# EAGLE design KickerBoard (EAGLE 9.2.2)

## Sheet 1 of 3: Power
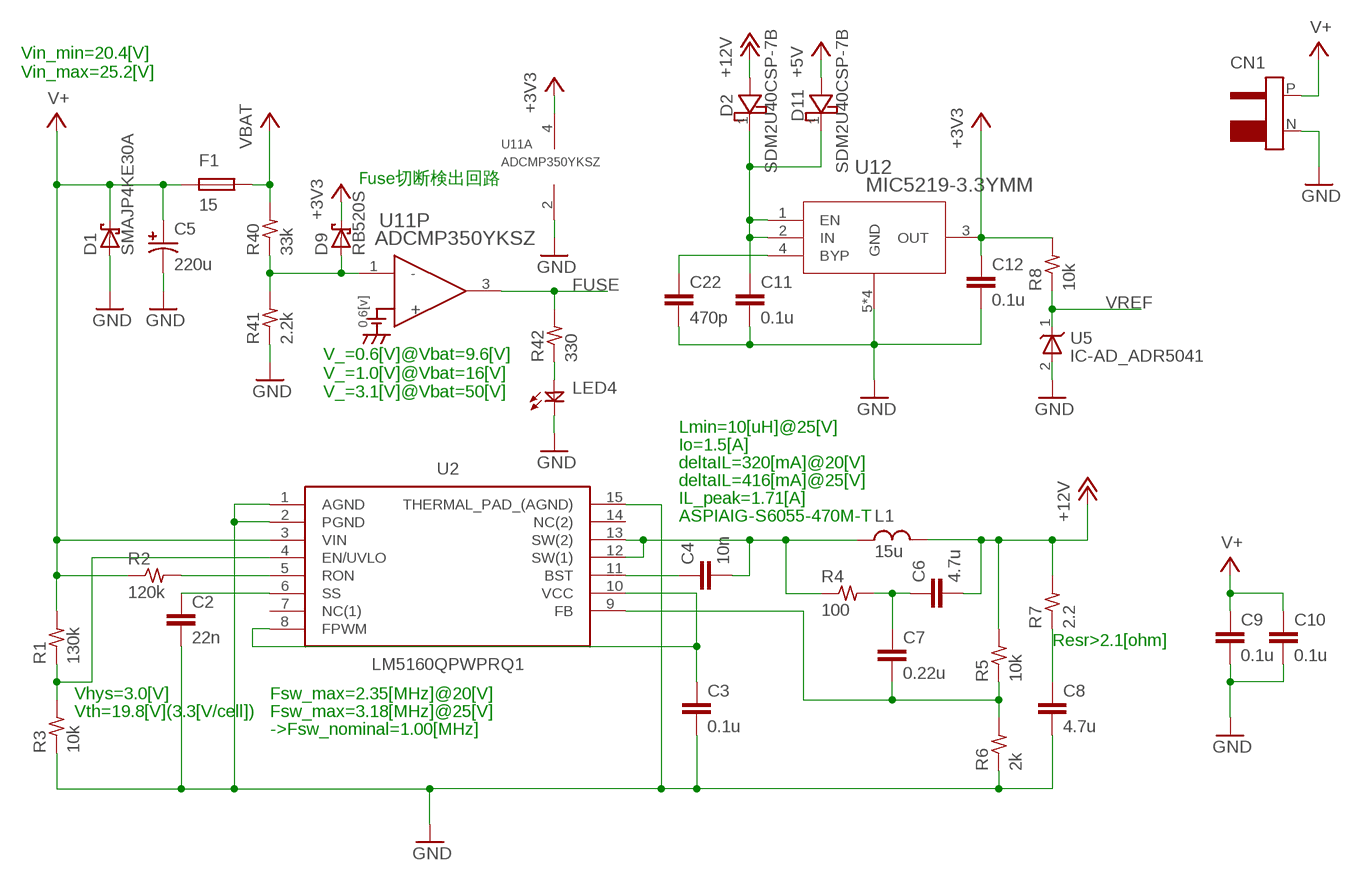
[diagram p0: schematic, sheet 1]

### Parts
C2  22n  C1005  [C1005]
C3  0.1u  C1005  [C1005]
C4  10n  C1005  [C1005]
C5  220u  CPOLS-6.3  [ES-6.3]
C6  4.7u  C1608  [C1608]
C7  0.22u  C1005  [C1005]
C8  4.7u  C1608  [C1608]
C9  0.1u  C1005  [C1005]
C10  0.1u  C1005  [C1005]
C11  0.1u  C1005  [C1005]
C12  0.1u  C1005  [C1005]
C22  470p  C1005  [C1005]
CN1  T-CON  [T-CON]
D1  SMAJP4KE30A  SBD-DO-214AC  [DO-214AC]
D2  SDM2U40CSP-7B  [X3-WLB1608-2]
D9  RB520S  SBD-SOD523  [DIODE_SOD523]
D11  SDM2U40CSP-7B  [X3-WLB1608-2]
F1  15  F3216  [3216]
L1  15u  L50  [L4949]
LED4  LED1608  [LED1608]
R1  130k  R1005  [R1005]
R2  120k  R1005  [R1005]
R3  10k  R1005  [R1005]
R4  100  R1608  [R1608]
R5  10k  R1005  [R1005]
R6  2k  R1005  [R1005]
R7  2.2  R1608  [R1608]
R8  10k  R1005  [R1005]
R40  33k  R1005  [R1005]
R41  2.2k  R1005  [R1005]
R42  330  R1005  [R1005]
U2  LM5160QPWPRQ1  [SOP65P640X110-15N]
U5  IC-AD_ADR5041  [IC-AD_SC70-3]
U11  ADCMP350YKSZ  [KS_4]
U12  MIC5219-3.3YMM  [MSOP-8_MM]

### Nets
+3V3: C12.1 D9.K R8.2 U11.4(A:VCC) U12.3(OUT) ; also sheet 2,3
+5V: D11.2(A) ; also sheet 2
+12V: C6.2 D2.2(A) L1.2 R5.2 R7.2 ; also sheet 3
FUSE: R42.2 U11.3(P:OUT) ; also sheet 2
GND: C2.2 C3.2 C5.N C8.2 C9.2 C10.2 C11.2 C12.2 C22.2 CN1.N D1.A LED4.K R3.1 R6.1 R41.1 U2.1(AGND) U2.2(PGND) U2.15(THERMAL_PAD_(AGND)) U5.2(A) U11.2(A:GND) U12.5(GND) U12.6(GND) U12.7(GND) U12.8(GND) ; also sheet 2,3
N$1: C8.1 R7.1
N$2: R2.2 U2.5(RON)
N$3: R1.1 R3.2 U2.4(EN/UVLO)
N$4: C2.1 U2.6(SS)
N$5: C3.1 U2.8(FPWM) U2.10(VCC)
N$7: C4.1 U2.11(BST)
N$8: C4.2 L1.1 R4.1 U2.12(SW(1)) U2.13(SW(2))
N$10: C6.1 C7.1 R4.2
N$11: C7.2 R5.1 R6.2 U2.9(FB)
N$40: C11.1 D2.1(K) D11.1(K) U12.1(EN) U12.2(IN)
N$45: D9.A R40.1 R41.2 U11.1(P:-)
N$49: LED4.A R42.1
N$54: C22.1 U12.4(BYP)
V+: C5.P C9.1 C10.1 CN1.P D1.K F1.1 R1.2 R2.1 U2.3(VIN)
VBAT: F1.2 R40.2 ; also sheet 3
VREF: R8.1 U5.1(K) ; also sheet 2
Unconnected: U2.7(NC(1)) U2.14(NC(2))

### Notes on the sheet
- Vin_min=20.4[V]
  Vin_max=25.2[V]
- Fuse切断検出回路
- V_=0.6[V]@Vbat=9.6[V]
  V_=1.0[V]@Vbat=16[V]
  V_=3.1[V]@Vbat=50[V]
- Lmin=10[uH]@25[V]
- Io=1.5[A]
- deltaIL=320[mA]@20[V]
- deltaIL=416[mA]@25[V]
- IL_peak=1.71[A]
- ASPIAIG-S6055-470M-T
- Resr>2.1[ohm]
- Vhys=3.0[V] | Fsw_max=2.35[MHz]@20[V]
- Vth=19.8[V](3.3[V/cell]) | Fsw_max=3.18[MHz]@25[V]
- ->Fsw_nominal=1.00[MHz]

## Sheet 2 of 3: MCU
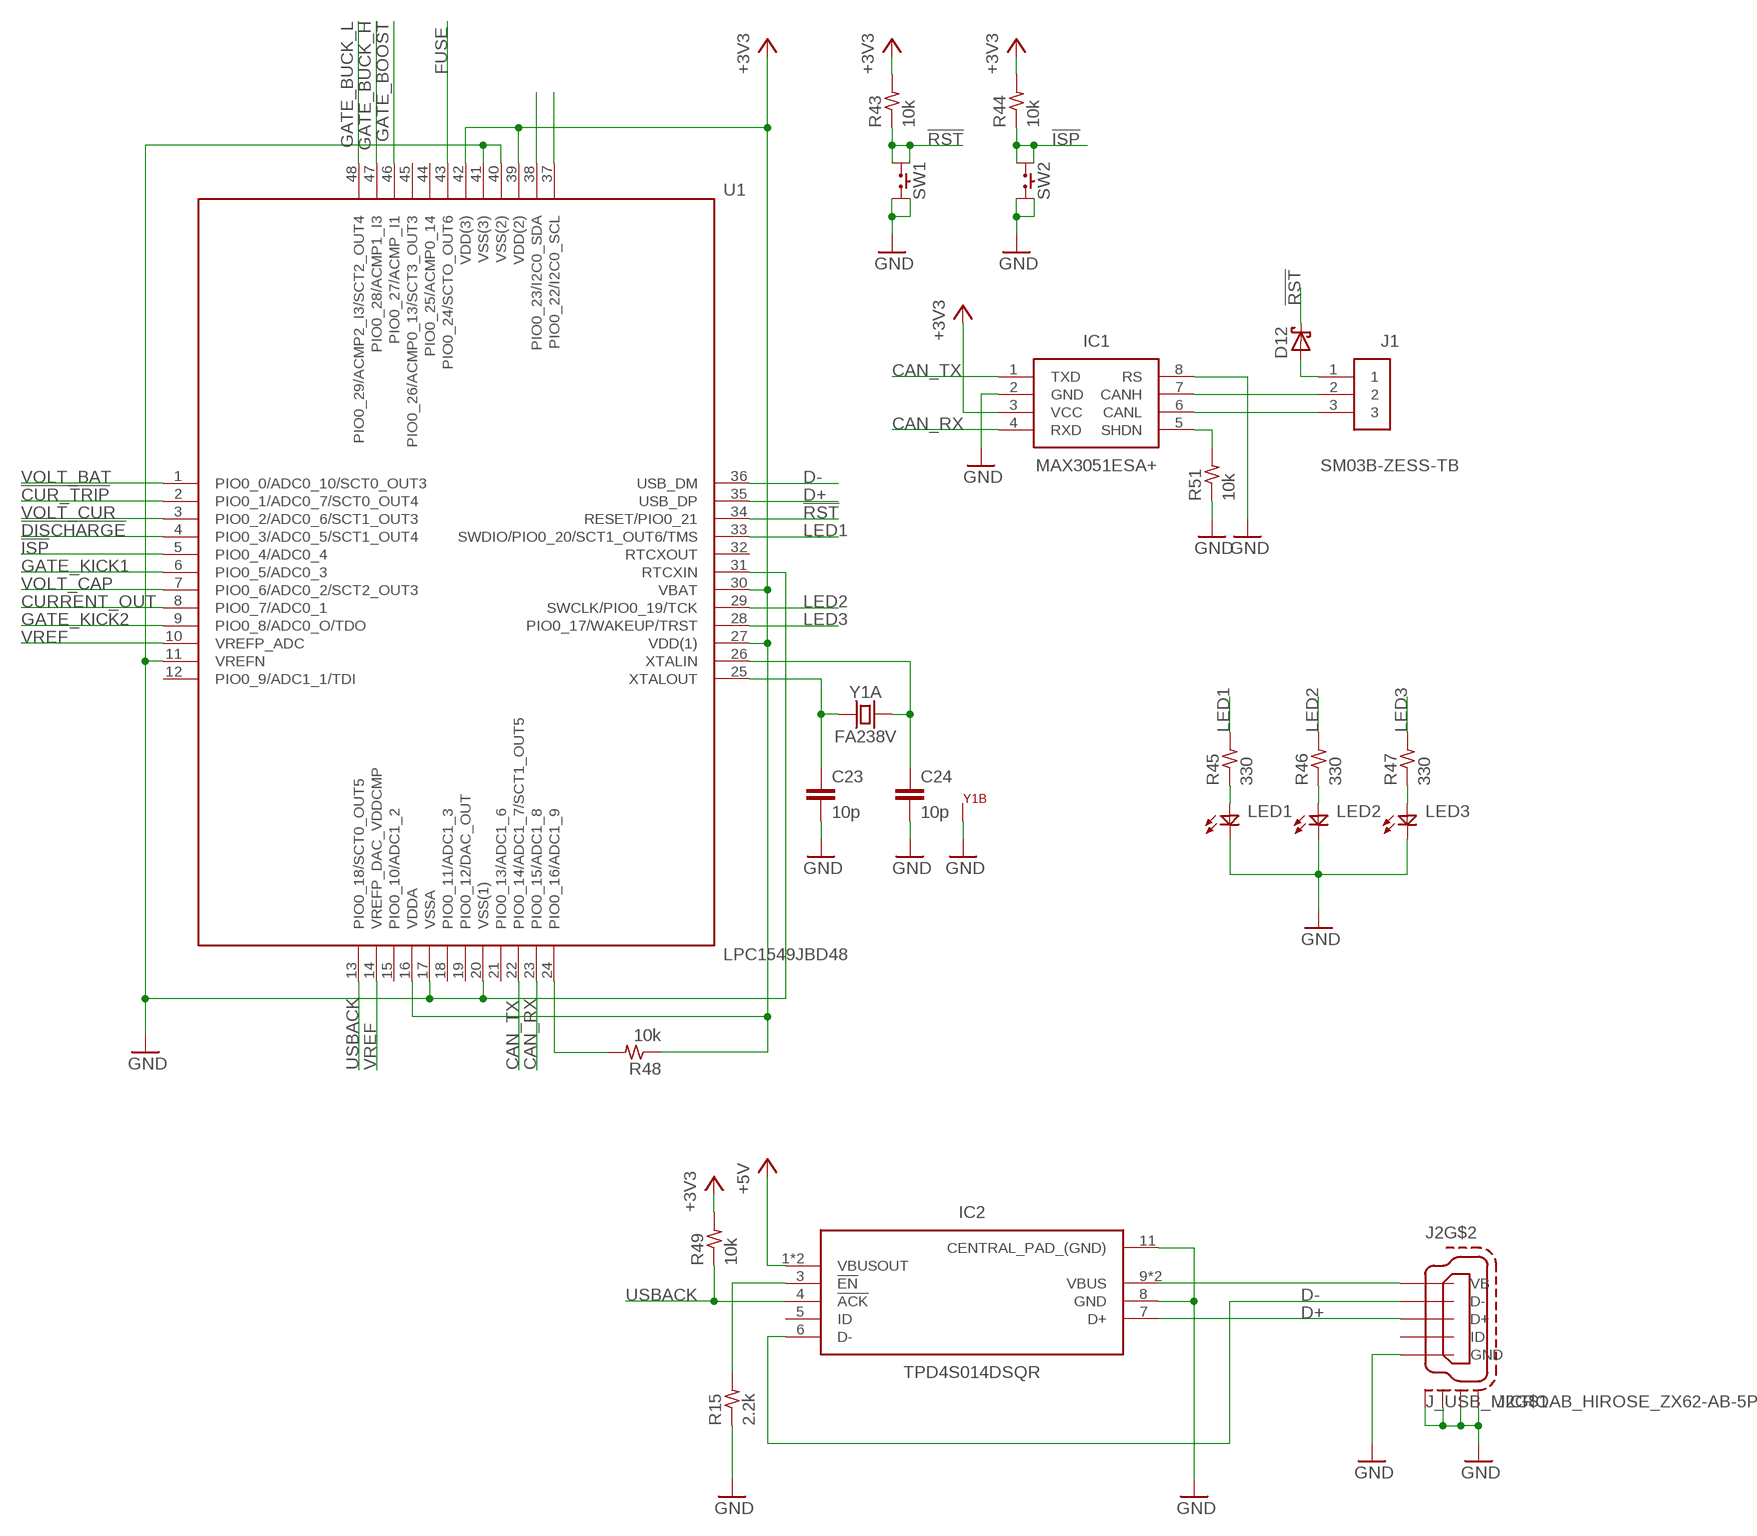
[diagram p1: schematic, sheet 2]

### Parts
C23  10p  C1005  [C1005]
C24  10p  C1005  [C1005]
D12  SBD-SOD523  [DIODE_SOD523]
IC1  MAX3051ESA+  [SOIC127P600X175-8N]
IC2  TPD4S014DSQR  [SON40P200X200X80-11N]
J1  SM03B-ZESS-TB  [SM03B-ZESS-TB]
J2  J_USB_MICROAB_HIROSE_ZX62-AB-5PA  [J_USB_MICROAB_HIROSE_ZX62-AB-5PA]
LED1  LED1608  [LED1608]
LED2  LED1608  [LED1608]
LED3  LED1608  [LED1608]
R15  2.2k  R1608  [1608]
R43  10k  R1005  [R1005]
R44  10k  R1005  [R1005]
R45  330  R1005  [R1005]
R46  330  R1005  [R1005]
R47  330  R1005  [R1005]
R48  10k  R1005  [R1005]
R49  10k  R1005  [R1005]
R51  10k  R1005  [R1005]
SW1  SKRP  [SKRP]
SW2  SKRP  [SKRP]
U1  LPC1549JBD48  [QFP48]
Y1  FA238V  [EPSON_FA238V]

### Nets
!CUR_TRIP: U1.2(PIO0_1/ADC0_7/SCT0_OUT4) ; also sheet 3
!DISCHARGE: U1.4(PIO0_3/ADC0_5/SCT1_OUT4) ; also sheet 3
!ISP: R44.1 SW2.A1 SW2.A2 U1.5(PIO0_4/ADC0_4)
!RST: D12.K R43.1 SW1.A1 SW1.A2 U1.34(RESET/PIO0_21)
+3V3: IC1.3(VCC) R43.2 R44.2 R48.1 R49.2 U1.16(VDDA) U1.27(VDD(1)) U1.30(VBAT) U1.39(VDD(2)) U1.42(VDD(3)) ; also sheet 1,3
+5V: IC2.1(VBUSOUT) IC2.2(VBUSOUT) ; also sheet 1
CAN_RX: IC1.4(RXD) U1.23(PIO0_15/ADC1_8)
CAN_TX: IC1.1(TXD) U1.22(PIO0_14/ADC1_7/SCT1_OUT5)
CURRENT_OUT: U1.8(PIO0_7/ADC0_1) ; also sheet 3
D+: IC2.7(D+) J2.P$3(D+) U1.35(USB_DP)
D-: IC2.6(D-) J2.P$2(D-) U1.36(USB_DM)
FUSE: U1.43(PIO0_24/SCTO_OUT6) ; also sheet 1
GATE_BOOST: U1.46(PIO0_27/ACMP_I1) ; also sheet 3
GATE_BUCK_H: U1.47(PIO0_28/ACMP1_I3) ; also sheet 3
GATE_BUCK_L: U1.48(PIO0_29/ACMP2_I3/SCT2_OUT4) ; also sheet 3
GATE_KICK1: U1.6(PIO0_5/ADC0_3) ; also sheet 3
GATE_KICK2: U1.9(PIO0_8/ADC0_O/TDO) ; also sheet 3
GND: C23.2 C24.2 IC1.2(GND) IC1.8(RS) IC2.8(GND) IC2.11(CENTRAL_PAD_(GND)) J2.P$5(GND) J2.SHIELD1(S1) J2.SHIELD2(S2) J2.SHIELD3(S3) J2.SHIELD4(S4) LED1.K LED2.K LED3.K R15.1 R51.1 SW1.B1 SW1.B2 SW2.B1 SW2.B2 U1.11(VREFN) U1.17(VSSA) U1.20(VSS(1)) U1.31(RTCXIN) U1.40(VSS(2)) U1.41(VSS(3)) Y1.2 Y1.4 ; also sheet 1,3
LED1: R45.2 U1.33(SWDIO/PIO0_20/SCT1_OUT6/TMS)
LED2: R46.2 U1.29(SWCLK/PIO0_19/TCK)
LED3: R47.2 U1.28(PIO0_17/WAKEUP/TRST)
N$9: LED1.A R45.1
N$23: IC2.3(!EN) R15.2
N$34: IC1.5(SHDN) R51.2
N$44: LED2.A R46.1
N$46: LED3.A R47.1
N$47: C24.1 U1.26(XTALIN) Y1.3
N$48: C23.1 U1.25(XTALOUT) Y1.1
N$50: R48.2 U1.24(PIO0_16/ADC1_9)
N$55: IC1.6(CANL) J1.3
N$56: IC2.9(VBUS) IC2.10(VBUS) J2.P$1(VB)
N$57: IC1.7(CANH) J1.2
N$58: D12.A J1.1
N$70: U1.38(PIO0_23/I2C0_SDA)
N$71: U1.37(PIO0_22/I2C0_SCL)
USBACK: IC2.4(!ACK) R49.1 U1.13(PIO0_18/SCT0_OUT5)
VOLT_BAT: U1.1(PIO0_0/ADC0_10/SCT0_OUT3) ; also sheet 3
VOLT_CAP: U1.7(PIO0_6/ADC0_2/SCT2_OUT3) ; also sheet 3
VOLT_CUR: U1.3(PIO0_2/ADC0_6/SCT1_OUT3) ; also sheet 3
VREF: U1.10(VREFP_ADC) U1.14(VREFP_DAC_VDDCMP) ; also sheet 1
Unconnected: IC2.5(ID) J2.P$4(ID) U1.12(PIO0_9/ADC1_1/TDI) U1.15(PIO0_10/ADC1_2) U1.18(PIO0_11/ADC1_3) U1.19(PIO0_12/DAC_OUT) U1.21(PIO0_13/ADC1_6) U1.32(RTCXOUT) U1.44(PIO0_25/ACMP0_14) U1.45(PIO0_26/ACMP0_13/SCT3_OUT3)

## Sheet 3 of 3: Charge
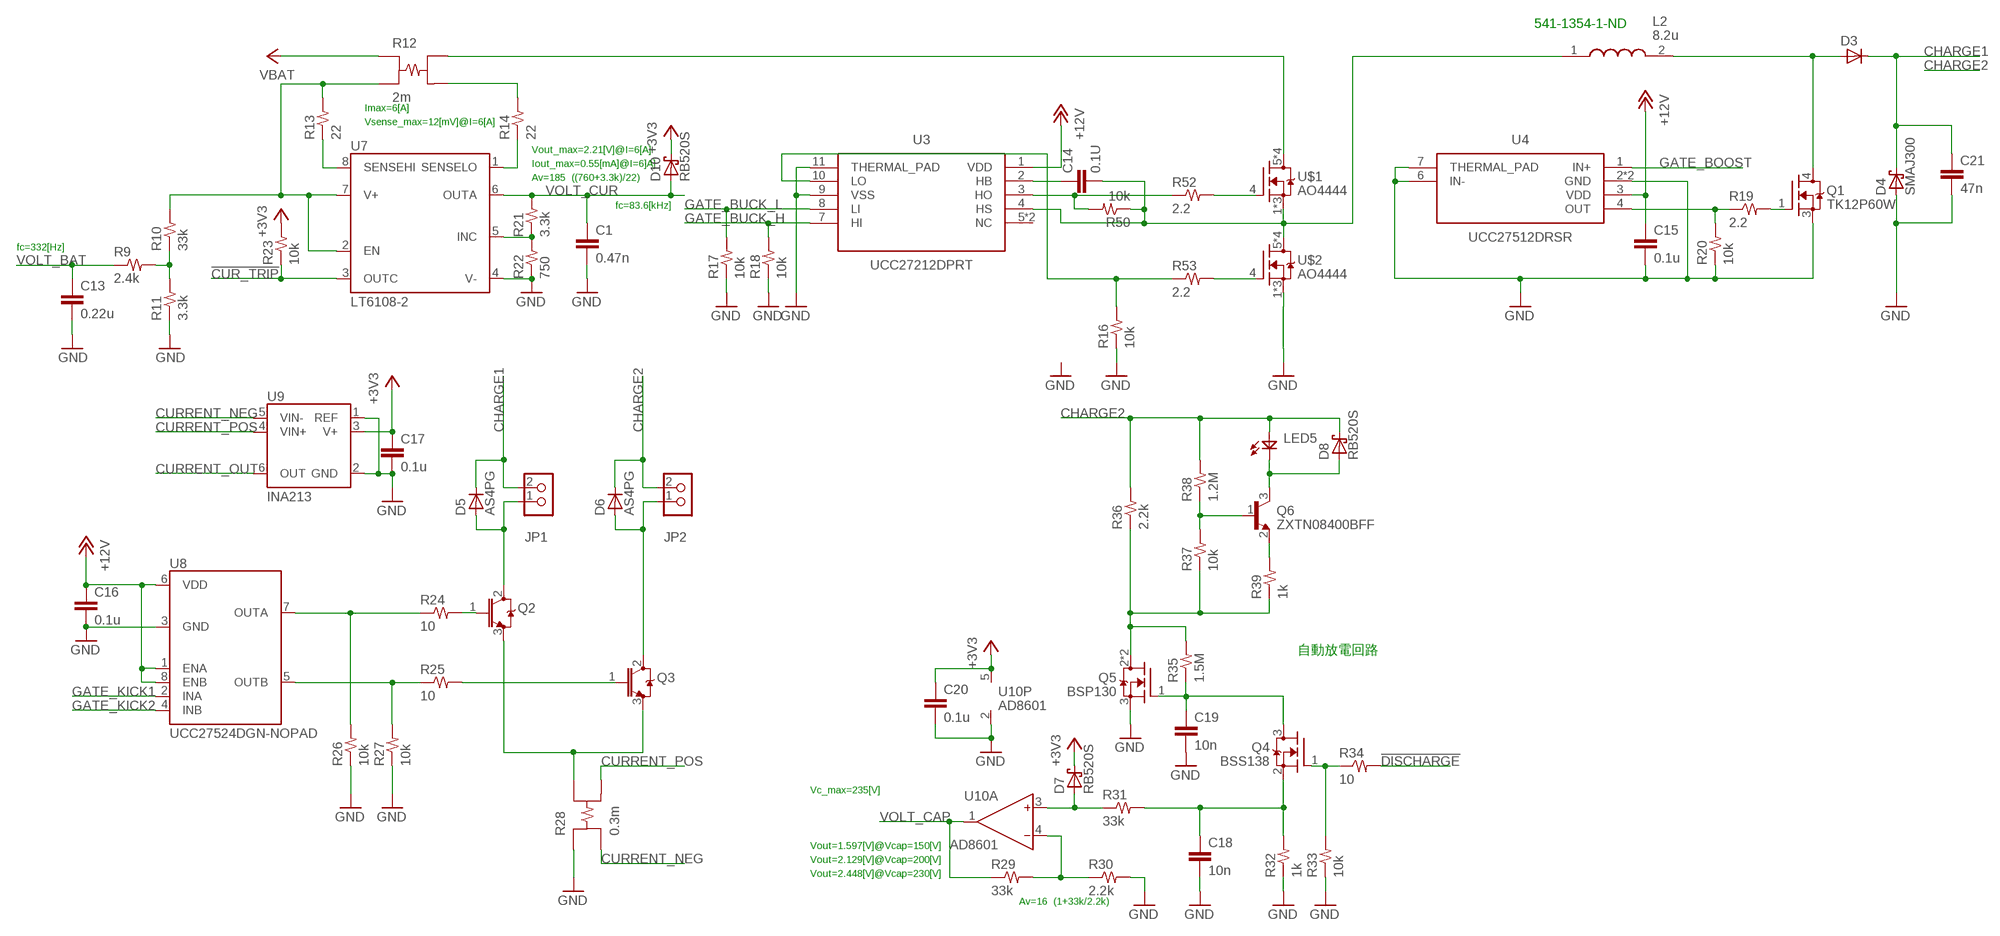
[diagram p2: schematic, sheet 3]

### Parts
C1  0.47n  C1005  [C1005]
C13  0.22u  C1005  [C1005]
C14  0.1U  C1005  [C1005]
C15  0.1u  C1005  [C1005]
C16  0.1u  C1005  [C1005]
C17  0.1u  C1005  [C1005]
C18  10n  C1005  [C1005]
C19  10n  C1005  [C1005]
C20  0.1u  C1005  [C1005]
C21  47n  C3216  [C3216]
D3  DIODE-DO-214AB  [DO-214AB]
D4  SMAJ300  SBD-DO-214AC  [DO-214AC]
D5  AS4PG  DIODE-SMPC  [SMPC]
D6  AS4PG  DIODE-SMPC  [SMPC]
D7  RB520S  SBD-SOD523  [DIODE_SOD523]
D8  RB520S  SBD-SOD523  [DIODE_SOD523]
D10  RB520S  SBD-SOD523  [DIODE_SOD523]
JP1  5569-02A2  [5569-02A2]
JP2  5569-02A2  [5569-02A2]
L2  8.2u  SRP6060FA-220M  [SRP6060FA220M]
LED5  LED1608  [LED1608]
Q1  TK12P60W  MOS-N-DPAK  [DPAK-3]
Q2  IGBT-1N  [TO-247AD_X1]
Q3  IGBT-1N  [TO-247AD_X1]
Q4  BSS138  MOS-N-SOT23  [SOT23-3]
Q5  BSP130  MOS-N-SOT223  [SOT223]
Q6  ZXTN08400BFF  NPN-SOT23  [SOT23-3]
R9  2.4k  R1005  [R1005]
R10  33k  R1005  [R1005]
R11  3.3k  R1005  [R1005]
R12  2m  R4-FC4L  [FC4L]
R13  22  R1608  [R1608]
R14  22  R1608  [R1608]
R16  10k  R1005  [R1005]
R17  10k  R1005  [R1005]
R18  10k  R1005  [R1005]
R19  2.2  R1608  [R1608]
R20  10k  R1005  [R1005]
R21  3.3k  R1005  [R1005]
R22  750  R1005  [R1005]
R23  10k  R1005  [R1005]
R24  10  R1608  [R1608]
R25  10  R1608  [R1608]
R26  10k  R1005  [R1005]
R27  10k  R1005  [R1005]
R28  0.3m  R4-WSL4026  [WSL4026]
R29  33k  R1005  [R1005]
R30  2.2k  R1005  [R1005]
R31  33k  R1005  [R1005]
R32  1k  R1005  [R1005]
R33  10k  R1005  [R1005]
R34  10  R1608  [R1608]
R35  1.5M  R1005  [R1005]
R36  2.2k  R-S-3  [RIEDON-S-3]
R37  10k  R1005  [R1005]
R38  1.2M  R1005  [R1005]
R39  1k  R1005  [R1005]
R50  10k  R1005  [R1005]
R52  2.2  R1608  [R1608]
R53  2.2  R1608  [R1608]
U3  UCC27212DPRT  [SON80P400X400X80-11N]
U4  UCC27512DRSR  [SON95P300X300X80-7N]
U7  LT6108-2  [MSOP8]
U8  UCC27524DGN-NOPAD  [MSOP8]
U9  INA213  [SC70-6]
U10  AD8601  SINGLE-OPAMP-ISO-SOT23  [SOT23-5]
U$1  AO4444  AO4440  [SOIC8]
U$2  AO4444  AO4440  [SOIC8]

### Nets
!CUR_TRIP: R23.1 U7.3(OUTC) ; also sheet 2
!DISCHARGE: R34.2 ; also sheet 2
+3V3: C17.1 C20.1 D7.K D10.K R23.2 U9.3(V+) U10.5(P:V+) ; also sheet 1,2
+12V: C15.1 C16.1 U3.1(VDD) U4.3(VDD) U8.1(ENA) U8.6(VDD) U8.8(ENB) ; also sheet 1
CHARGE1: C21.1 D3.K D4.K D5.K JP1.2
CHARGE2: D6.K D8.K JP2.2 LED5.A R36.2 R38.2
CURRENT_NEG: R28.I1 U9.5(VIN-)
CURRENT_OUT: U9.6(OUT) ; also sheet 2
CURRENT_POS: R28.I2 U9.4(VIN+)
GATE_BOOST: U4.1(IN+) ; also sheet 2
GATE_BUCK_H: R18.2 U3.7(HI) ; also sheet 2
GATE_BUCK_L: R17.2 U3.8(LI) ; also sheet 2
GATE_KICK1: U8.2(INA) ; also sheet 2
GATE_KICK2: U8.4(INB) ; also sheet 2
GND: C1.2 C13.2 C15.2 C16.2 C17.2 C18.2 C19.2 C20.2 C21.2 D4.A Q1.3(S) Q5.3(S) R11.1 R16.1 R17.1 R18.1 R20.1 R22.1 R26.1 R27.1 R28.V1 R30.2 R32.1 R33.1 U3.9(VSS) U3.11(THERMAL_PAD) U4.2(GND) U4.5(GND) U4.6(IN-) U4.7(THERMAL_PAD) U7.4(V-) U8.3(GND) U9.1(REF) U9.2(GND) U10.2(P:V-) U$2.1(S) U$2.2(S) U$2.3(S) ; also sheet 1,2
N$6: R24.1 R26.2 U8.7(OUTA)
N$12: R9.2 R10.1 R11.2
N$13: R10.2 R12.I1 R13.2 U7.2(EN) U7.7(V+)
N$14: R13.1 U7.8(SENSEHI)
N$15: R29.2 R30.1 U10.4(A:IN-)
N$16: R14.1 U7.1(SENSELO)
N$17: R12.I2 R14.2
N$18: R12.V2 U$1.5(D) U$1.6(D) U$1.7(D) U$1.8(D)
N$19: R16.2 R53.1 U3.10(LO)
N$20: R50.2 R52.1 U3.3(HO)
N$21: C14.2 L2.1 R50.1 U3.4(HS) U$1.1(S) U$1.2(S) U$1.3(S) U$2.5(D) U$2.6(D) U$2.7(D) U$2.8(D)
N$22: C14.1 U3.2(HB)
N$24: D3.A L2.2 Q1.4(D)
N$25: R19.1 R20.2 U4.4(OUT)
N$26: Q1.1(G) R19.2
N$27: R25.1 R27.2 U8.5(OUTB)
N$28: R21.1 R22.2 U7.5(INC)
N$29: Q2.1(G) R24.2
N$30: Q3.1(G) R25.2
N$31: Q2.3(E) Q3.3(E) R28.V2
N$32: D5.1(A) D5.2(A) JP1.1 Q2.2(C)
N$33: D7.A R31.1 U10.3(A:IN+)
N$35: D6.1(A) D6.2(A) JP2.1 Q3.2(C)
N$36: C18.1 Q4.2(S) R31.2 R32.2
N$37: Q4.1(G) R33.2 R34.1
N$38: C19.1 Q4.3(D) Q5.1(G) R35.1
N$39: Q5.2(D) Q5.4(D) R35.2 R36.1 R37.1 R39.1
N$41: Q6.1(B) R37.2 R38.1
N$42: Q6.2(E) R39.2
N$43: D8.A LED5.K Q6.3(C)
N$52: R52.2 U$1.4(G)
N$53: R53.2 U$2.4(G)
VBAT: R12.V1 ; also sheet 1
VOLT_BAT: C13.1 R9.1 ; also sheet 2
VOLT_CAP: R29.1 U10.1(A:OUT) ; also sheet 2
VOLT_CUR: C1.1 D10.A R21.2 U7.6(OUTA) ; also sheet 2
Unconnected: U3.5(NC) U3.6(NC)

### Notes on the sheet
- 541-1354-1-ND
- Imax=6[A]
- Vsense_max=12[mV]@I=6[A]
- Vout_max=2.21[V]@I=6[A]
- Iout_max=0.55[mA]@I=6]A]
- Av=185  ((760+3.3k)/22)
- fc=83.6[kHz]
- fc=332[Hz]
- 自動放電回路
- Vc_max=235[V]
- Vout=1.597[V]@Vcap=150[V]
- Vout=2.129[V]@Vcap=200[V]
- Vout=2.448[V]@Vcap=230[V]
- Av=16  (1+33k/2.2k)

## Library data of the parts
C1-C4 C6-C24 = MotorDriver:C
C5 = Passive:CPOL
CN1 = Connector:T-CON
D1 D4 D7-D10 D12 = MotorDriver:SBD-*
D2 D11 = SDM2U40CSP-7B:SDM2U40CSP-7B: 2A SCHOTTKY BARRIER RECTIFIER CHIP SCALE PACKAGE Source: Datasheet <https://www.diodes.com/assets/Datasheets/SDM2U40CSP.pdf>; DESCRIPTION: 2A SCHOTTKY BARRIER RECTIFIER CHIP SCALE PACKAGE; HEIGHT: mm; MANUFACTURER_NAME: Diodes Inc.; MANUFACTURER_PART_NUMBER: SDM2U40CSP-7B; SUPPLIER_NAME: RS
D3 D5 D6 = diode:DIODE-*
F1 = Passive:F
IC1 = MAX3051ESA+:MAX3051ESA+: CAN Transceiver 1 Mbit/s ISO 11898 Standby-Mode 8pins SOIC <https://componentsearchengine.com/Images/3/MAX3051ESA%2B.jpg> Source: Datasheet <http://datasheets.maximintegrated.com/en/ds/MAX3051.pdf>; DESCRIPTION: CAN Transceiver 1 Mbit/s ISO 11898 Standby-Mode 8pins SOIC; HEIGHT: 1.75mm; MANUFACTURER_NAME: Maxim Integrated; MANUFACTURER_PART_NUMBER: MAX3051ESA+; RS_PART_NUMBER: 7329005; SUPPLIER_NAME: RS
IC2 = TPD4S014DSQR:TPD4S014DSQR: Texas Instruments TPD4S014DSQR, USB Controller, 480Mbit/s, USB 2.0, 10-Pin SON <https://componentsearchengine.com/Images/3/TPD4S014DSQR.jpg> Source: Datasheet <http://www.ti.com/lit/gpn/tpd4s014>; DESCRIPTION: Texas Instruments TPD4S014DSQR, USB Controller, 480Mbit/s, USB 2.0, 10-Pin SON; HEIGHT: 0.8mm; MANUFACTURER_NAME: Texas Instruments; MANUFACTURER_PART_NUMBER: TPD4S014DSQR; RS_PART_NUMBER: 7422968; SUPPLIER_NAME: RS
J1 = SM03B-ZESS-TB:SM03B-ZESS-TB: JST (JAPAN SOLDERLESS TERMINALS) - SM03B-ZESS-TB - HEADER, ZE, SIDE, SMT, 3WAY Source: Datasheet <http://www.jst-mfg.com/product/pdf/eng/eZE.pdf>; DESCRIPTION: JST (JAPAN SOLDERLESS TERMINALS) - SM03B-ZESS-TB - HEADER, ZE, SIDE, SMT, 3WAY; HEIGHT: mm; MANUFACTURER_NAME: JST (JAPAN SOLDERLESS TERMINALS); MANUFACTURER_PART_NUMBER: SM03B-ZESS-TB; SUPPLIER_NAME: RS
J2 = j_usb_hirose_zx62-ab-5pa:J_USB_MICROAB_HIROSE_ZX62-AB-5PA: USB Micro-AB SMT connector Hirose Electric Co Ltd: ZX62-AB-5P
JP1 JP2 = con-molex:5569-02A2
L1 = Passive:L
L2 = SRP6060FA-220M:SRP6060FA-220M: Fixed Inductors 22uH 20% 5A Source: Datasheet <https://www.bourns.com/docs/Product-Datasheets/SRP6060FA.pdf>; ALLIED_NUMBER: 71262024; DESCRIPTION: Fixed Inductors 22uH 20% 5A; HEIGHT: 6mm; MANUFACTURER_NAME: Bourns; MANUFACTURER_PART_NUMBER: SRP6060FA-220M
LED1-LED5 = MotorDriver:LED
Q1 Q4 Q5 = transistor:MOS-N-*
Q2 Q3 = ProjectOnly:IGBT-1N
Q6 = Transistor:NPN-
R1-R11 R13 R14 R16-R27 R29-R35 R37-R53 = MotorDriver:R
R12 R28 = ProjectFromKIKS:R4-*
R15 = Passive:R
R36 = ProjectOnly:R-*
SW1 SW2 = MotorDriver:SKRP
U1 = MotorDriver:LPC1549JBD48: NXP - LPC1549JBD48 - 32BIT MCU, CORTEX-M3, 72 MHZ, LQFP-48 Source: Datasheet <http://www.farnell.com/datasheets/1963077.pdf>; DESCRIPTION: NXP - LPC1549JBD48 - 32BIT MCU, CORTEX-M3, 72 MHZ, LQFP-48; HEIGHT: 1.6mm; MANUFACTURER_NAME: NXP; MANUFACTURER_PART_NUMBER: LPC1549JBD48; SUPPLIER_NAME: RS
U2 = LM5160QPWPRQ1:LM5160QPWPRQ1: Voltage Regulators - Switching Regulators Wide Input 65V, 1.5A Synchronous Buck / Fly-Buck? Converter 14-HTSSOP -40 to 125 <https://componentsearchengine.com/Images/1/LM5160QPWPRQ1.jpg> Source: Datasheet <http://www.ti.com/lit/gpn/lm5160-q1>; DESCRIPTION: Voltage Regulators - Switching Regulators Wide Input 65V, 1.5A Synchronous Buck / Fly-Buck? Converter 14-HTSSOP -40 to 125; HEIGHT: 1.1mm; MANUFACTURER_NAME: Texas Instruments; MANUFACTURER_PART_NUMBER: LM5160QPWPRQ1; SUPPLIER_NAME: RS
U3 = UCC27212DPRT:UCC27212DPRT: Gate Drivers 120-V Boot, 4-A Peak, High-Frequency High-Side and Low-Side Driver 10-WSON -40 to 140 <https://componentsearchengine.com/Images/9/UCC27212DPRT.jpg> Source: Datasheet <http://www.ti.com/lit/ds/symlink/ucc27212.pdf>; DESCRIPTION: Gate Drivers 120-V Boot, 4-A Peak, High-Frequency High-Side and Low-Side Driver 10-WSON -40 to 140; HEIGHT: 0.8mm; MANUFACTURER_NAME: Texas Instruments; MANUFACTURER_PART_NUMBER: UCC27212DPRT; SUPPLIER_NAME: RS
U4 = UCC27512DRSR:UCC27512DRSR: 4A/8A Single Channel High-speed Low-side Gate Driver <https://store.ti.com/Assets/ProductImages/ucc27512.jpg> Source: Datasheet <http://www.ti.com/lit/gpn/ucc27512>; DESCRIPTION: 4A/8A Single Channel High-speed Low-side Gate Driver; HEIGHT: 0.8mm; MANUFACTURER_NAME: Texas Instruments; MANUFACTURER_PART_NUMBER: UCC27512DRSR; SUPPLIER_NAME: RS
U5 = MotorDriver_Rev1:IC-AD_ADR504*
U7 = ic-LT:LT6108-2
U8 = ic-TI:UCC27524
U9 = ic-TI:INA21*; GAIN: 50
U10 = Opamp:SINGLE-OPAMP-ISO
U11 = adcmp350:ADCMP350YKSZ; MANUFACTURER_PART_NUMBER: ADCMP350YKSZREEL7; VENDOR: Analog Devices Inc
U12 = MIC5219-3.3YMM:MIC5219-3.3YMM; MANUFACTURER_PART_NUMBER: MIC52193.3YMM; VENDOR: Micrel
U$1 U$2 = MDULib:AO4440
Y1 = FA238V:FA238V: MHz RANGE CRYSTAL UNIT Source: Datasheet <https://support.epson.biz/td/api/doc_check.php?mode=dl&lang=en&Parts=FA-238V>; DESCRIPTION: MHz RANGE CRYSTAL UNIT; HEIGHT: mm; MANUFACTURER_NAME: Epson ICs; MANUFACTURER_PART_NUMBER: FA238V; SUPPLIER_NAME: RS

## Board
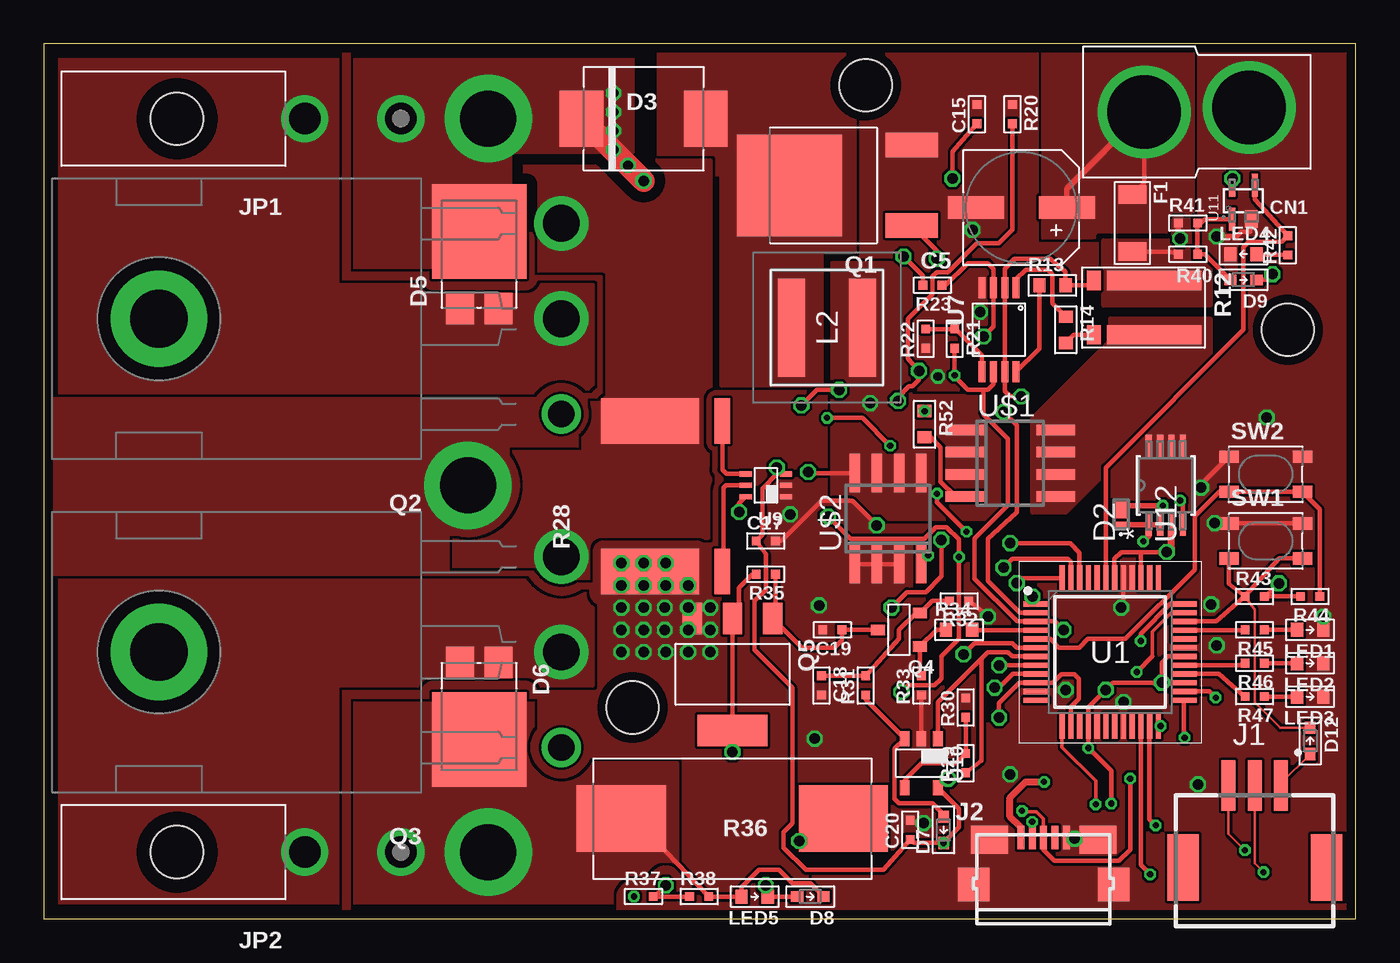
[diagram p3: board, top side]
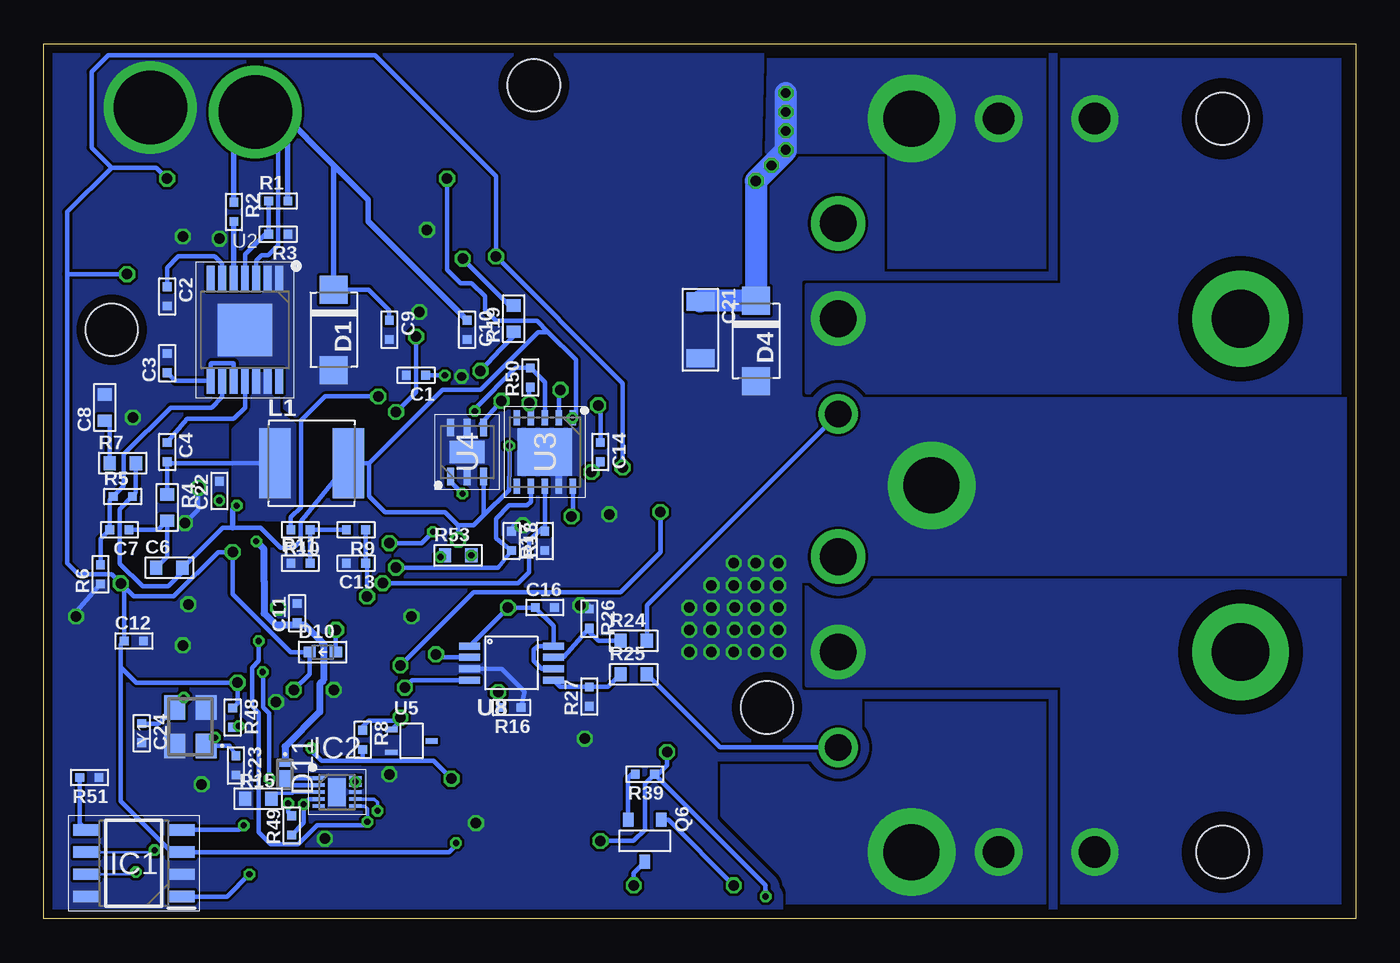
[diagram p4: board, bottom side, seen from below]

Size 75 x 50 mm. Coordinates in mm from the lower left corner, seen from the top.
Outline: 0,0 75,0 75,50 0,50 0,0
Copper layers (1*16): Top 0.035mm / dielectric 1.6mm / Bottom 0.035mm
Design rules "Elecrow_2-layer_PCB_eagle_rule": minimum track width 6mil, minimum drill 12mil, track to track 6mil, track to pad 6mil, pad to pad 6mil, via to via 8mil, smd to smd 0mil, copper to edge 20mil, drill to drill 10mil, minimum pad ring 6mil, minimum via ring 6mil, stop-mask expansion 0mil, vias tented up to drill 100mil, thermal gap 10mil
Holes 3 mm at 46.99,47.62 33.66,12.06 71.12,33.66

### Footprints (pad centres in the part's own frame; a part is rotated, then mirrored left to right if it is on the bottom)
C1005 = smd 0.5 x 0.5: 1 -0.55,0; 2 0.55,0
ES-6.3 = smd 3.2 x 1.3: N 2.6,0; P -2.6,0
C1608 = smd 0.7 x 0.8: 1 -0.75,0; 2 0.75,0
C3216 = smd 1.05 x 1.6: 1 -1.625,0; 2 1.625,0
T-CON = drill 4.2 pad 5.3: N -3,-0.25; P 3,0
DO-214AC = smd 1.6 x 1.6: A 2.3,0; K -2.3,0
X3-WLB1608-2 = smd 0.385 x 0.69: 1 -0.619,0 | smd 1.035 x 0.69: 2 0.293,0
DO-214AB = smd 2.5 x 3.2: A 3.55,0; K -3.55,0
SMPC = smd 1.6 x 1.8: 1 1.1,-3.1; 2 -1.1,-3.1 | smd 5.4 x 5.4: K 0,1.3
DIODE_SOD523 = smd 0.7 x 0.6: A 0.75,0; K -0.75,0
3216 = smd 1.05 x 1.6: 1 -1.625,0; 2 1.625,0
SOIC127P600X175-8N = smd 1.525 x 0.65: 1 -2.712,1.905; 2 -2.712,0.635; 3 -2.712,-0.635; 4 -2.712,-1.905; 5 2.712,-1.905; 6 2.712,-0.635; 7 2.712,0.635; 8 2.712,1.905
SON40P200X200X80-11N = smd 0.7 x 0.2: 1 -1.05,0.8; 2 -1.05,0.4; 3 -1.05,0; 4 -1.05,-0.4; 5 -1.05,-0.8; 6 1.05,-0.8; 7 1.05,-0.4; 8 1.05,0; 9 1.05,0.4; 10 1.05,0.8 | smd 1 x 1.6: 11 0,0
SM03B-ZESS-TB = smd 0.8 x 2.9: 1 1.5,0; 2 0,0; 3 -1.5,0 | smd 1.8 x 3.8: 4 -4.1,-4.7; 5 4.1,-4.7
J_USB_MICROAB_HIROSE_ZX62-AB-5PA = smd 0.4 x 1.35: P$1 -1.3,4.125; P$2 -0.65,4.125; P$3 0,4.125; P$4 0.65,4.125; P$5 1.3,4.125 | smd 1.8 x 1.9: SHIELD1 -4,1.45; SHIELD4 4,1.45 | smd 2.1 x 1.6: SHIELD2 -3.1,4; SHIELD3 3.1,4
5569-02A2 = drill 1.8 pad 2.4: 1 0,-7.3; 2 0,-12.8 | hole 3: 0,0
L4949 = smd 1.8 x 4: 1 -2.1,0; 2 2.1,0
SRP6060FA220M = smd 5.6 x 1.55: 1 0,2.025; 2 0,-2.025
LED1608 = smd 0.7 x 0.8: A 0.75,0; K -0.75,0
DPAK-3 = smd 1.4 x 3: 1 -2.3,-2; 3 2.3,-2 | smd 5.8 x 6: 4 0,5
TO-247AD_X1 = drill 1.5 pad 2.1: 1 -5.45,-8 | drill 2.1 pad 3: 2 0,-8; 3 5.45,-8 | drill 3.3 pad 5.5: S 0,15
SOT23-3 = smd 0.6 x 0.8: 1 -0.95,-1.2; 2 0.95,-1.2; 3 0,1.2
SOT223 = smd 1.1 x 1.8: 1 -2.3,-3.2; 2 0,-3.2; 3 2.3,-3.2 | smd 4 x 1.8: 4 0,3.2
R1005 = smd 0.5 x 0.5: 1 -0.55,0; 2 0.55,0
R1608 = smd 0.7 x 0.8: 1 -0.75,0; 2 0.75,0
FC4L = smd 1.1 x 0.8: I1 -1.55,-2.85; I2 1.55,-2.85 | smd 1.1 x 5.4: V1 -1.55,0.6; V2 1.55,0.6
1608 = smd 0.7 x 0.8: 1 -0.75,0; 2 0.75,0
WSL4026 = smd 2.6 x 0.89: I1 -4.3,-3.235; I2 4.3,-3.235 | smd 2.6 x 5.6: V1 -4.3,0.9; V2 4.3,0.9
RIEDON-S-3 = smd 5.1 x 3.8: 1 -6.35,0; 2 6.35,0
SKRP = smd 1.1 x 0.7: A1 -2.1,-1; A2 2.1,-1; B1 -2.1,1; B2 2.1,1
QFP48 = smd 1.45 x 0.3: 1 -4.225,2.75; 2 -4.225,2.25; 3 -4.225,1.75; 4 -4.225,1.25; 5 -4.225,0.75; 6 -4.225,0.25; 7 -4.225,-0.25; 8 -4.225,-0.75; 9 -4.225,-1.25; 10 -4.225,-1.75; 11 -4.225,-2.25; 12 -4.225,-2.75; 25 4.225,-2.75; 26 4.225,-2.25; 27 4.225,-1.75; 28 4.225,-1.25; 29 4.225,-0.75; 30 4.225,-0.25; 31 4.225,0.25; 32 4.225,0.75; 33 4.225,1.25; 34 4.225,1.75; 35 4.225,2.25; 36 4.225,2.75 | smd 0.3 x 1.45: 13 -2.75,-4.225; 14 -2.25,-4.225; 15 -1.75,-4.225; 16 -1.25,-4.225; 17 -0.75,-4.225; 18 -0.25,-4.225; 19 0.25,-4.225; 20 0.75,-4.225; 21 1.25,-4.225; 22 1.75,-4.225; 23 2.25,-4.225; 24 2.75,-4.225; 37 2.75,4.225; 38 2.25,4.225; 39 1.75,4.225; 40 1.25,4.225; 41 0.75,4.225; 42 0.25,4.225; 43 -0.25,4.225; 44 -0.75,4.225; 45 -1.25,4.225; 46 -1.75,4.225; 47 -2.25,4.225; 48 -2.75,4.225
SOP65P640X110-15N = smd 1.45 x 0.45: 1 -2.925,1.95; 2 -2.925,1.3; 3 -2.925,0.65; 4 -2.925,0; 5 -2.925,-0.65; 6 -2.925,-1.3; 7 -2.925,-1.95; 8 2.925,-1.95; 9 2.925,-1.3; 10 2.925,-0.65; 11 2.925,0; 12 2.925,0.65; 13 2.925,1.3; 14 2.925,1.95 | smd 3 x 3.1: 15 0,0
SON80P400X400X80-11N = smd 0.85 x 0.35: 1 -1.95,1.6; 2 -1.95,0.8; 3 -1.95,0; 4 -1.95,-0.8; 5 -1.95,-1.6; 6 1.95,-1.6; 7 1.95,-0.8; 8 1.95,0; 9 1.95,0.8; 10 1.95,1.6 | smd 2.7 x 3.1: 11 0,0
SON95P300X300X80-7N = smd 1 x 0.4: 1 -1.4,0.95; 2 -1.4,0; 3 -1.4,-0.95; 4 1.4,-0.95; 5 1.4,0; 6 1.4,0.95 | smd 1.3 x 2: 7 0,0
IC-AD_SC70-3 = smd 0.3 x 0.7: 1 -0.65,-1.15; 2 0.65,-1.15; 3 0,1.15
MSOP8 = smd 0.4 x 1.2: 1 -0.975,-2.4; 2 -0.325,-2.4; 3 0.325,-2.4; 4 0.975,-2.4; 5 0.975,2.4; 6 0.325,2.4; 7 -0.325,2.4; 8 -0.975,2.4
SC70-6 = smd 0.3 x 0.7: 1 -0.65,-1.15; 2 0,-1.15; 3 0.65,-1.15; 4 0.65,1.15; 5 0,1.15; 6 -0.65,1.15
SOT23-5 = smd 0.55 x 0.85: 1 -0.95,-1.4; 2 0,-1.4; 3 0.95,-1.4; 4 0.95,1.4; 5 -0.95,1.4
KS_4 = smd 0.356 x 1.308: 1 -0.65,-1.041; 3 0.65,0.895; 4 -0.65,0.895 | smd 0.762 x 1.016: 2 0.447,-1.041
MSOP-8_MM = smd 1.245 x 0.356: 1 -2.261,0.975; 2 -2.261,0.325; 3 -2.261,-0.325; 4 -2.261,-0.975; 5 2.261,-0.975; 6 2.261,-0.325; 7 2.261,0.325; 8 2.261,0.975
SOIC8 = smd 0.6 x 2.2: 1 -1.905,-2.6; 2 -0.635,-2.6; 3 0.635,-2.6; 4 1.905,-2.6; 5 1.905,2.6; 6 0.635,2.6; 7 -0.635,2.6; 8 -1.905,2.6
EPSON_FA238V = smd 1.4 x 1.2: 1 -1.1,-0.9; 2 1.1,-0.9; 3 1.1,0.9; 4 -1.1,0.9

### Placement (x,y rotation side)
C1  53.72,31.05 180 bottom
C2  67.94,35.56 270 bottom
C3  67.94,31.75 90 bottom
C4  67.94,26.67 270 bottom
C5  55.88,40.64 180 top
C6  67.82,20.07 0 bottom
C7  70.68,22.23 180 bottom
C8  71.5,29.21 90 bottom
C9  55.24,33.66 270 bottom
C10  50.8,33.66 270 bottom
C11  60.52,17.46 90 bottom
C12  69.85,15.88 0 bottom
C13  57.15,20.32 180 bottom
C14  43.18,26.67 270 bottom
C15  53.34,45.97 90 top
C16  46.35,17.78 0 bottom
C17  41.27,21.59 0 top
C18  44.45,13.34 270 top
C19  45.09,16.51 180 top
C20  49.53,5.08 90 top
C21  37.47,33.66 270 bottom
C22  64.96,24.45 90 bottom
C23  64.01,8.76 270 bottom
C24  69.41,10.6 270 bottom
CN1  65.91,46.1 180 top
D1  58.42,33.66 270 bottom
D2  61.59,23.11 90 top
D3  34.29,45.72 0 top
D4  34.29,33.02 270 bottom
D5  24.89,37.97 0 top
D6  24.89,11.56 180 top
D7  51.44,5.08 90 top
D8  43.81,1.27 180 top
D9  68.58,36.51 180 top
D10  59.05,15.24 0 bottom
D11  61.21,8.26 270 bottom
D12  72.39,10.16 270 top
F1  62.23,39.75 270 top
IC1  69.85,3.17 180 bottom
IC2  58.23,7.24 0 bottom
J1  69.22,7.62 0 top
J2  57.15,0.51 0 top
JP1  7.62,45.72 90 top
JP2  7.62,3.81 90 top
L1  59.69,26.04 0 bottom
L2  44.77,33.78 270 top
LED1  72.39,16.51 180 top
LED2  72.39,14.61 180 top
LED3  72.39,12.7 180 top
LED4  68.58,37.97 0 top
LED5  40.64,1.27 180 top
Q1  47.62,41.91 90 top
Q2  21.59,34.29 90 top
Q3  21.59,15.24 90 top
Q4  48.9,16.51 90 top
Q5  39.37,13.97 180 top
Q6  40.64,4.45 180 bottom
R1  61.59,41.02 0 bottom
R2  64.14,40.39 270 bottom
R3  61.59,39.12 180 bottom
R4  67.94,23.5 270 bottom
R5  70.48,24.13 0 bottom
R6  71.75,19.68 90 bottom
R7  70.48,26.04 0 bottom
R8  56.77,10.22 270 bottom
R9  57.15,22.23 180 bottom
R10  60.33,22.23 180 bottom
R11  60.33,20.32 0 bottom
R12  62.87,34.92 270 top
R13  57.66,36.2 0 top
R14  58.42,33.66 270 top
R15  62.74,6.86 0 bottom
R16  48.26,12.06 180 bottom
R17  46.35,21.59 90 bottom
R18  48.26,21.59 270 bottom
R19  48.13,34.29 90 bottom
R20  55.37,45.97 270 top
R21  52.07,33.15 270 top
R22  50.42,33.15 90 top
R23  50.8,36.2 180 top
R24  41.27,15.88 0 bottom
R25  41.27,13.97 0 bottom
R26  43.81,17.14 270 bottom
R27  43.81,12.7 90 bottom
R28  35.56,24.13 90 top
R29  52.7,8.89 90 top
R30  52.7,12.06 90 top
R31  46.99,13.34 90 top
R32  52.32,18.16 180 top
R33  50.16,13.34 90 top
R34  52.32,16.51 0 top
R35  41.27,19.68 180 top
R36  39.37,5.71 180 top
R37  34.29,1.27 0 top
R38  37.47,1.27 0 top
R39  40.64,8.26 180 bottom
R40  65.41,37.97 180 top
R41  65.41,39.75 0 top
R42  71.12,38.48 90 top
R43  69.22,18.41 0 top
R44  72.39,18.41 180 top
R45  69.22,16.51 180 top
R46  69.22,14.61 180 top
R47  69.22,12.7 180 top
R48  64.2,11.49 270 bottom
R49  60.83,5.33 90 bottom
R50  47.18,30.92 90 bottom
R51  72.39,8.06 180 bottom
R52  50.36,28.26 270 top
R53  51.31,20.76 0 bottom
SW1  69.85,21.59 0 top
SW2  69.85,25.4 0 top
U1  60.96,15.24 0 top
U2  63.5,33.66 270 bottom
U3  46.35,26.67 270 bottom
U4  50.8,26.67 90 bottom
U5  53.98,10.16 270 bottom
U7  54.61,33.66 180 top
U8  48.26,14.61 270 bottom
U9  41.27,24.77 90 top
U10  50.16,8.89 180 top
U11  68.58,41.02 0 top
U12  64.14,24.77 90 top
U$1  55.24,26.04 270 top
U$2  48.26,22.86 0 top
Y1  66.61,10.99 90 bottom

### Tracks (layer width: path | path; a pad name or v marks a point on that pad's centre or on a via)
!CUR_TRIP  (via drill 0.6)
  Top 0.254: U1.2 55.79,17.49 53.98,19.3 53.98,21.72 55.63,23.24 55.63,28.19 v54.86,28.96 | v53.72,33.27 54.28,33.84 U7.3 54.28,37.16 53.98,37.47 52.82,37.47 51.55,36.2 R23.1
  Bottom 0.254: v54.86,28.96 53.72,30.1 v53.72,33.27
!DISCHARGE
  Top 0.254: U1.4 53.09,16.49 R34.2
!ISP
  Top 0.254: U1.5 57.54,15.99 58.04,15.49 59.19,15.49 59.69,15.99 61.84,15.99 65.79,19.94 65.79,22.99 67.2,24.4 SW2.A1 SW2.A2 72.94,23.41 R44.1
!RST
  Top 0.152: D12.K 70.68,10.91 69.39,12.21 69.22,12.38 69.22,17.66 R43.1
  Top 0.254: R43.1 67.04,16.99 U1.34 | R43.1 67.75,19.13 SW1.A1 | R43.1 70.64,20.59 SW1.A2
+3V3  (via drill 0.35, 0.6)
  Top 0.254: U11.4 67.93,42.28 v67.94,42.29 | R44.2 R43.2 69.97,18.53 v70.6,19.16 | U1.39 62.71,20.8 62.67,20.95 | 62.67,20.95 v64.2,20.95 | U1.42 61.21,20.57 61.59,20.95 62.67,20.95 | v51.69,8 51.18,7.49 U10.5 52.32,6.28 52.32,5.22 D7.K 49.73,4.33 C20.1 47.99,2.79 43.56,2.79 42.29,4.06 42.29,4.95 42.8,5.46 42.8,13.21 40.64,15.37 40.64,18.16 41.27,18.8 41.27,20.84 C17.1 41.08,21.95 41.08,24.57 41.92,25.41 | U9.3 41.92,25.41 | 41.92,25.41 41.92,25.77 v41.91,25.78 | D9.K 69.91,36.51 v70.23,36.83 | U1.30 64.27,14.99 63.91,14.64 v63.91,13.49 | v63.91,13.49 U1.27 | v63.91,13.49 61.12,13.49 v60.71,13.08 59.71,12.09 U1.16 v59.71,9.76 61.02,8.45 v61.02,6.58 | R23.2 50.25,36.74 v49.15,37.85
  Top 0.406: v64.2,20.95 64.46,21.22 U12.3
  Bottom 0.254: v67.94,42.29 68.58,42.93 71.12,42.93 | 73.66,36.83 73.66,40.39 71.12,42.93 | 73.66,36.83 73.66,20.32 73.03,19.68 71.12,19.68 v70.6,19.16 70.4,18.96 | 70.4,18.96 69.85,18.41 67.56,18.41 65.02,20.95 v64.2,20.95 64.2,18.54 60.9,15.24 D10.K 59.8,13.98 v60.71,13.08 | 56.77,9.02 59.12,9.02 59.71,9.61 v59.71,9.76 | 56.77,9.02 52.7,9.02 v51.69,8 | v70.23,36.83 73.66,36.83 | v41.91,25.78 41.91,30.61 v49.15,37.85 49.15,42.42 56.07,49.34 71.31,49.34 72.26,48.39 72.26,44.07 71.12,42.93 | 70.6,14.38 69.71,13.49 v63.91,13.49 63.91,12.33 R48.1 | 70.6,14.38 70.6,6.72 67.69,3.81 IC1.3 51.82,3.81 51.44,4.19 D7.K | v61.02,6.58 61.02,6.07 R49.2 | 70.4,18.96 C12.1 70.6,15.68 70.6,14.38 | R8.2 56.77,9.02
  other vias: 51.44,4.33
+5V
  Bottom 0.254: IC2.1 61.14,8.04 D11.2 60.89,7.64 IC2.2
+12V  (via drill 0.35, 0.6)
  Top 0.254: v48.46,17.78 49.35,18.67 50.42,18.67 51.31,19.56 v51.31,21.65 | C15.1 51.94,43.83 v51.94,42.29 | v48.38,27.03 46.79,28.62 v44.78,28.62
  Top 0.305: D2.2 61.79,23.61 v63.97,23.61
  Bottom 0.254: U8.1 v48.46,17.78 C16.1 45.86,16.73 U8.8 46.78,15.58 46.99,15.37 46.99,14.73 46.54,14.28 U8.6 | 56.39,26.04 L1.2 60.33,22.7 60.33,21.59 60.71,21.21 61.47,21.21 62.61,22.35 64.2,22.35 64.78,22.35 C6.2 67.07,19.82 67.9,18.99 69.34,18.99 70.66,20.3 70.66,23.41 R5.2 69.73,24.33 R7.2 | 56.39,26.04 52.2,30.23 50.04,30.23 46.74,33.53 46.16,33.53 | 56.39,26.04 56.39,24.13 55.5,23.24 52.07,23.24 51.31,22.48 | 51.31,22.48 v51.31,21.65 | U4.3 49.85,23.05 | 49.85,23.05 50.42,22.48 51.31,22.48 | v51.94,42.29 51.94,37.08 51.18,36.32 50.55,36.32 49.78,35.56 49.78,34.8 49.16,34.17 46.81,34.17 46.16,33.53 | 46.16,33.53 44.58,31.94 44.58,28.8 U3.1 v44.78,28.62 | 49.85,23.05 | 49.85,23.05 48.41,24.49 48.41,25.26 48.38,25.29 v48.38,27.03
  Bottom 0.305: v63.97,23.61 64.2,23.38 64.2,22.35
CAN_RX  (via drill 0.35)
  Top 0.254: U1.23 63.21,5.69 v63.56,5.33
  Bottom 0.254: v63.56,5.33 63.82,5.08 IC1.4
CAN_TX  (via drill 0.35)
  Top 0.254: U1.22 62.71,3.08 v63.25,2.54
  Bottom 0.254: v63.25,2.54 64.52,1.27 IC1.1
CHARGE1  (via drill 0.55, 0.6, 3.2 pad 5)
  Top 1.27: v34.29,42.17 D3.K
  Bottom 1.27: C21.1 37.42,35.32 D4.K v34.29,42.17 v34.28,42.17 v33.4,43.05 32.58,43.88 v32.58,43.94 v32.58,45.02 v32.58,46.1 v32.58,47.18
  other vias: 25.4,45.72
  pour Top (isolate 0.813, rank 2, no thermals): 33.66,50.04 17.27,50.04 17.27,36.83 26.67,36.83 26.67,43.81 33.66,43.81
  pour Bottom (isolate 0.813, rank 2, no thermals): 33.53,50.04 17.14,50.04 17.27,36.83 26.67,36.83 26.67,43.81 33.66,43.81
CHARGE2  (via drill 3.2 pad 5)
  Top 0.254: R36.2 33.77,5.71 R38.2 LED5.A 39.89,1.79 40.89,2.79 42.04,2.79 42.8,2.03 43.81,2.03 44.56,1.28 D8.K
  other vias: 25.4,3.81
  pour Top (isolate 0.813, rank 2, no thermals): 17.27,0.13 36.2,0 36.2,8.89 27.94,8.89 27.94,12.83 17.27,12.83
  pour Bottom (isolate 0.813, rank 2, no thermals): 17.27,0 36.2,-0.13 36.2,8.89 27.94,8.89 27.94,12.83 17.27,12.83
CURRENT_NEG
  Top 0.254: R28.I1 38.86,19.9 38.86,24.64 38.99,24.77 U9.5
CURRENT_OUT  (via drill 0.6)
  Top 0.254: v39.75,23.24 39.75,23.74 U9.6 | U1.8 54.62,14.49 v54.61,14.48
  Bottom 0.254: v54.61,14.48 50.42,18.67 42.04,18.67 39.75,20.95 v39.75,23.24
CURRENT_POS
  Top 0.254: R28.I2 38.8,25.66 39.04,25.41 U9.4
D+  (via drill 0.35)
  Top 0.2: v55.92,6.17 55.97,6.12 56.74,6.12 57.15,5.71 J2.P$3 | 63.37,16.41 63.37,14.99
  Top 0.203: U1.35 64.45,17.49 63.37,16.41
  Top 0.254: J2.P$3 57.15,3.94 57.78,3.3 61.47,3.3 62.1,3.94 v62.1,8.01 | 63.37,14.99 v62.48,14.1
  Bottom 0.2: v55.92,6.17 55.92,6.64 56.12,6.84 IC2.7
  Bottom 0.254: v62.48,14.1 62.45,14.07 62.45,12.08 62.1,11.73 v62.1,8.01
D-  (via drill 0.35)
  Top 0.2: J2.P$2 v56.5,5.54
  Top 0.254: U1.36 64.41,17.99 62.71,16.29 v62.71,15.88
  Bottom 0.2: v56.5,5.54 56.5,6.27 56.67,6.44 IC2.6
  Bottom 0.254: v62.71,15.88 62.71,14.73 63.09,14.35 63.09,12.14 62.71,11.76 62.71,4.94 62.02,4.25 60.45,4.25 59.37,5.33 56.7,5.33 v56.5,5.54
FUSE
  Top 0.254: U11.3 69.23,41.12 R42.2 70.76,38.67 68.87,38.67 68.58,38.38 68.58,33.66 60.71,25.79 U1.43
GATE_BOOST  (via drill 0.35, 0.6)
  Top 0.254: U1.46 59.21,20.93 58.67,21.46 v55.24,21.46 | v52.75,22.11 51.06,23.8 v51.06,24.29
  Bottom 0.254: v51.06,24.29 51.75,24.98 U4.1 | v52.75,22.11 53.4,21.46 v55.24,21.46
GATE_BUCK_H  (via drill 0.6)
  Top 0.254: v54.86,20.07 55.37,20.57 58.55,20.57 58.71,20.41 U1.47
  Bottom 0.254: v54.86,20.07 49.03,20.07 R18.2 49.15,21.73 49.15,22.86 48.39,23.62 47.37,23.62 47.16,23.84 U3.7
GATE_BUCK_L  (via drill 0.6)
  Top 0.254: U1.48 55.91,19.46 v55.63,19.18
  Bottom 0.254: U3.8 R17.2 46.49,22.34 47.24,21.59 47.24,19.81 47.88,19.18 v55.63,19.18
GATE_KICK1  (via drill 0.6)
  Top 0.254: v52.58,15.11 53.21,15.75 55.37,15.75 55.63,15.49 U1.6
  Bottom 0.254: v52.58,15.11 52.4,14.93 U8.2
GATE_KICK2  (via drill 0.6)
  Top 0.254: v54.36,13.21 54.61,13.21 55.39,13.99 U1.9
  Bottom 0.254: v54.36,13.21 53.93,13.63 U8.4
GND  (via drill 0.5, 0.6, 3.2 pad 5)
  Top 0.254: v61.59,17.78 61.71,17.89 U1.41 | U11.2 68.96,39.91 68.96,39.24 68.45,39.24 68.2,38.99 v67.06,38.99 | v73.15,17.27 v73.14,17.26 LED1.K | v47.62,22.48 46.23,23.88 44.45,23.88 42.16,21.59 C17.2 | R32.1 53.96,17.27 v53.98,17.27 | U10.2 R33.1 | C20.2 49.9,5.46 v50.29,5.46 | SW1.B2 SW1.B1 67.73,22.61 v66.93,22.61 | v66.17,24.64 66.17,24.82 SW2.B1 | U$2.3 U$2.2 U$2.1
  Top 0.305: R41.1 64.86,38.97 v64.96,38.86
  Bottom 0.254: R6.1 73.15,17.54 v73.15,17.27 | v44.32,17.91 43.83,17.91 R26.1 | U8.3 48.82,14.28 47.51,12.97 R16.1 | v66.93,22.61 66.17,23.37 v66.17,24.64 | v47.62,22.48 48.12,22.48 R18.1
  Bottom 0.406: U3.9 45.55,25.87 U3.11
  other vias: 58.42,13.08 55.24,8.26 51.12,30.99 34.29,20.32 53.53,34.67 69.91,28.64 42.67,23.11 44.07,10.29 67.06,15.62 24.26,24.77 33.02,20.32 34.29,19.05 33.02,19.05 35.56,20.32 53.09,39.37 61.72,12.38 58.93,4.57 65.98,7.68 35.56,19.05 36.83,19.05 33.02,17.78 34.29,17.78 35.5,17.78 36.83,17.78 38.1,17.78 33.02,16.51 34.29,16.51 35.5,16.51 36.83,16.51 38.1,16.51 33.02,15.24 34.29,15.24 35.56,15.24 36.83,15.24 38.1,15.24 66.74,17.97
  pour Bottom (isolate 0.127, rank 6, no thermals): -1.91,52.07 76.83,52.07 76.83,-1.91 -1.91,-1.91
  pour Top (isolate 0.127, rank 6, no thermals): -3.17,53.34 78.11,53.34 78.11,-3.17 -3.17,-3.17
LED1
  Top 0.254: R45.2 68.44,16.49 U1.33
LED2
  Top 0.254: R46.2 68.35,14.49 U1.29
LED3
  Top 0.254: R47.2 67.17,13.99 U1.28
N$1
  Bottom 0.254: C8.1 71.23,28.19 R7.1
N$2
  Bottom 0.305: R2.2 64.15,39.82 U2.5
N$3
  Bottom 0.254: R1.1 R3.2 62.34,39.12 63.5,37.96 U2.4
N$4
  Bottom 0.254: U2.6 64.8,37.43 65.22,37.85 67.31,37.85 67.94,37.21 C2.1
N$5
  Bottom 0.254: U2.10 64.14,30.75 64.14,31.75 65.41,31.75 65.45,31.7 U2.8 67.47,30.73 C3.1
N$6
  Bottom 0.254: U8.7 45.28,14.93 R26.2 43.81,16.39 43.3,15.88 R24.1
N$7
  Bottom 0.254: U2.11 63.5,29.21 64.14,28.57 66.79,28.57 C4.1
N$8
  Bottom 0.254: R4.1 C4.2 67.83,26.04 L1.1
  pour Bottom (rank 5, no thermals): 63.5,31.11 63.5,28.57 64.14,27.94 64.14,22.86 60.58,22.8 60.64,28.19 61.59,28.96 61.59,31.11
N$9
  Top 0.254: R45.1 LED1.A
N$10
  Bottom 0.254: C7.1 68.47,22.23 R4.2 67.94,20.69 C6.1
N$11
  Bottom 0.254: U2.9 64.8,29.82 65.41,29.21 67.75,29.21 70.42,26.54 70.42,24.74 R5.1 71.22,23.94 C7.2 71.75,21.7 R6.2
N$12
  Bottom 0.254: R9.2 R10.1 R11.2
N$13  (via drill 0.6)
  Top 0.254: v55.88,29.84 55.24,29.84 54.94,30.16 U7.7 U7.2 54.94,37.16 55.5,37.72 57.53,37.72 58.41,36.97 R13.2 59.73,36.2 R12.I1
  Bottom 0.254: v55.88,29.84 58.93,29.84 60.29,28.48 60.29,23.53 60.88,22.95 R10.2
N$14
  Top 0.254: R13.1 56.91,32.58 U7.8
N$15
  Top 0.254: R30.1 R29.2 52.16,8.89 50.16,8.89 49.22,7.94 U10.4
N$16
  Top 0.254: U7.1 55.59,36.53 56.13,37.08 57.4,37.08 57.66,36.83 57.66,35.17 R14.1
N$17
  Top 0.254: R14.2 58.89,33.38 R12.I2
N$18
  pour Top (no thermals): 60.96,34.29 60.96,33.02 56.52,28.57 56.52,23.24 58.42,23.24 66.67,31.5 66.67,34.29
N$19  (via drill 0.35, 0.6)
  Top 0.254: v44.83,22.99 46.1,21.72 50.34,21.72 51.01,22.39 51.61,22.39 52.32,21.67 v52.32,20.67 52.32,16 51.31,14.99 51.31,13.72 50.93,13.34 49.4,13.34 v49.02,12.95
  Bottom 0.254: v44.83,22.99 44.76,23.06 U3.10 | v49.02,12.95 49.02,12.08 R16.2 | R53.1 52.15,20.67 v52.32,20.67
N$20  (via drill 0.35)
  Bottom 0.254: R52.1 50.35,29.15 48.03,31.47 R50.2 46.35,30.65 U3.3
  other vias: 50.36,29.01
N$21  (via drill 0.6)
  Top 0.254: U$2.8 43.76,25.46 v43.69,25.53
  Bottom 0.254: v43.69,25.53 43.3,25.92 C14.2 | U3.4 47.16,29.38 v47.24,29.46 47.24,30.11 R50.1
  pour Top (no thermals): 45.09,37.47 45.09,22.86 54.61,22.86 54.61,29.84 49.53,29.84 49.53,37.47
N$22  (via drill 0.6)
  Top 0.254: v43.31,29.34 44.2,30.23 v45.47,30.23
  Bottom 0.254: C14.1 43.18,29.21 v43.31,29.34 | v45.47,30.23 45.55,30.14 U3.2
N$23
  Bottom 0.203: IC2.3 60.72,7.24 60.78,7.18 61.67,7.18 R15.2
N$24
  pour Top (rank 4, no thermals): 44.45,30.48 44.45,38.1 46.35,38.1 46.35,50.04 35.18,50.04 35.18,42.55 38.73,42.55 38.73,30.48
N$25  (via drill 0.6)
  Top 0.254: R20.2 55.37,39.37 54.61,38.61 53.34,38.61 51.69,36.96 51.05,36.96 50.8,36.7 50.8,35.69 49.4,34.29 49.4,32 v50.04,31.3 50.04,30.8 49.66,30.42 49.47,30.42 48.83,29.78 v48.83,29.59
  Bottom 0.254: U4.4 50.04,28.26 v48.83,29.59 | v50.04,31.3 48.88,32.53 48.13,33.27 R19.1
N$26  (via drill 0.6)
  Top 0.254: Q1.1 51.05,38.18 v51.05,37.72
  Bottom 0.254: v51.05,37.72 48.38,35.04 R19.2
N$27
  Bottom 0.254: R25.1 42.74,13.25 R27.2 45.48,13.25 U8.5
N$28
  Top 0.254: U7.5 53.63,32.2 52.07,33.77 R21.1 R22.2
N$29
  Bottom 0.254: R24.2 40.52,17.91 Q2.1
N$30
  Bottom 0.254: R25.2 36.34,9.79 Q3.1
N$31
  pour Top (isolate 0.61, rank 3, no thermals): 27.3,43.31 38.1,43.31 38.1,19.49 23.5,19.49 23.5,26.67 30.86,26.67 30.86,36.83 27.3,36.83
N$32
  pour Top (isolate 0.813, no thermals): 16.76,50.04 0,50.04 0,30.1 31.37,30.1 31.37,36.2 16.76,36.2
  pour Bottom (isolate 0.813, no thermals): 16.76,50.04 0,50.04 0,30.1 31.37,30.1 31.37,36.2 16.76,36.2
N$33
  Top 0.254: D7.A 51.44,5.97 50.8,6.6 48.9,6.6 48.64,6.86 48.64,9.72 U10.3 46.99,12.52 R31.1
N$34
  Bottom 0.254: R51.2 72.94,5.46 IC1.5
N$35
  pour Top (isolate 0.813, no thermals): 16.76,0 0,0.13 0,19.3 31.37,19.3 31.37,13.34 16.76,13.34
  pour Bottom (isolate 0.813, no thermals): 16.76,0 0,0.13 0,19.3 31.37,19.3 31.37,13.34 16.76,13.34
N$36
  Top 0.254: C18.1 R31.2 48.9,15.99 48.9,16.51 49.84,17.46 Q4.2 50.8,18.16 R32.2
N$37
  Top 0.254: R34.1 51.05,16.51 Q4.1 50.09,14.15 R33.2
N$38
  Top 0.254: Q4.3 C19.1 45.63,15.92 45.21,15.49 43.35,15.49 Q5.1 41.83,17.32 R35.1
N$39  (via drill 0.35, 0.6)
  Top 0.254: v43.18,4.45 44.45,4.45 R36.1 | v39.37,9.53 Q5.4 Q5.2 39.75,17.55 39.75,18.91 40.52,19.68 R35.2
  Bottom 0.254: v43.18,4.45 41.27,4.45 40.64,5.08 40.64,7.71 R39.1 | v39.37,9.53 39.37,8.78 39.89,8.26 R39.1 | R39.1 33.74,1.91 R37.1
  other vias: 33.74,1.27
N$40  (via drill 0.35)
  Top 0.305: D2.1 61.6,22.5 U12.1 | U12.2 U12.1 | U12.1 63.16,21.87 v62.85,21.56
  Bottom 0.254: C11.1 60.52,16.79
  Bottom 0.406: v62.85,21.56 62.4,21.12 62.4,19.3 62.4,17.45 61.75,16.79 60.52,16.79 60.1,16.79 59.01,15.7 59.01,13.63 59.23,13.42 59.23,11.83 61.21,9.84 D11.1
N$41  (via drill 0.6)
  Top 0.254: R38.1 R37.2 35.04,1.39 v35.56,1.91
  Bottom 0.254: Q6.1 39.3,5.64 v35.56,1.91
N$42
  Bottom 0.254: Q6.2 41.59,8.05 41.39,8.26 R39.2
N$43  (via drill 0.6)
  Top 0.254: D8.A LED5.K 41.27,1.39 v41.27,1.91
  Bottom 0.254: v41.27,1.91 41.27,2.61 Q6.3
N$44
  Top 0.254: R46.1 LED2.A
N$45
  Top 0.254: U11.1 66.38,39.98 66.16,39.75 R41.2 R40.1 66.37,37.97 D9.A
N$46
  Top 0.254: R47.1 LED3.A
N$47  (via drill 0.35)
  Top 0.254: U1.26 66.64,12.99 v66.99,12.64
  Bottom 0.254: v66.99,12.64 67.51,12.12 Y1.3 68.44,11.15 C24.1
N$48  (via drill 0.35)
  Top 0.254: U1.25 65.19,10.38 v65.22,10.35
  Bottom 0.254: v65.22,10.35 65.68,9.89 Y1.1 64.38,9.89 C23.1
N$49
  Top 0.254: R42.1 69.37,37.93 LED4.A
N$50  (via drill 0.35)
  Top 0.254: v63.84,11.02 U1.24
  Bottom 0.254: R48.2 64.13,11.02 v63.84,11.02
N$52
  Top 0.254: U$1.4 52.12,24.13 51.27,24.98 51.27,26.95 50.71,27.51 R52.2
N$53  (via drill 0.35)
  Top 0.254: R53.2 50.16,20.37 U$2.4
  other vias: 50.56,20.76
N$54  (via drill 0.35)
  Top 0.254: C22.1 65.11,23.75 U12.4
  other vias: 64.96,23.9
N$55  (via drill 0.35)
  Top 0.152: J1.3 67.72,4.86 v68.66,3.92
  Bottom 0.152: v68.66,3.92 68.77,3.81 IC1.6
N$56  (via drill 0.35)
  Top 0.406: J2.P$1 55.85,5.22 55.24,5.83 55.24,6.91 56.14,7.82 v57.18,7.82
  Bottom 0.254: IC2.9 v57.18,7.82 IC2.10
N$57  (via drill 0.35)
  Top 0.152: J1.2 69.22,3.17 v69.72,2.67
  Bottom 0.152: v69.72,2.67 69.85,2.54 IC1.7
N$58
  Top 0.152: D12.A 70.72,7.74 J1.1
USBACK  (via drill 0.35)
  Top 0.2: U1.13 58.21,9.8 60.13,7.87 v60.13,6.54
  Bottom 0.2: v60.13,6.54
  Bottom 0.254: R49.1 60.13,5.48 v60.13,6.54 59.84,6.84 IC2.4
V+
  Top 0.254: 62.87,46.1 CN1.P 62.91,42.06 F1.1
  Top 0.305: C5.P 58.48,41.72 62.87,46.1
  Bottom 0.254: U2.3 62.85,37.61 62.55,37.91 62.17,37.91 61.59,38.48 61.59,44.78 | D1.K 56.42,35.95 55.24,34.78 C9.1
  Bottom 0.305: CN1.P 61.59,44.78 61.05,44.23 R1.2 | CN1.P 64.14,44.88 R2.1 | D1.K 58.42,43.05 | 58.42,43.05 61.47,46.1 CN1.P | C10.1 56.45,39.86 56.45,41.08 58.42,43.05
  pour Top (isolate 0.305, rank 5, no thermals): 57.15,49.97 57.15,38.93 65.66,38.99 65.66,50.04
VBAT
  Top 0.254: F1.2 63.44,38.13 64.38,38.13 R40.2
  pour Top (no thermals): 60.58,35.05 60.58,38.73 65.66,38.73 65.66,37.47 66.67,37.47 66.67,35.05
VOLT_BAT  (via drill 0.6)
  Top 0.254: U1.1 56.52,18.21 v56.52,18.41
  Bottom 0.254: R9.1 C13.1 56.52,20.2 v56.52,18.41
VOLT_CAP
  Top 0.254: U10.1 51.12,12.38 53.59,14.86 | R29.1 53.59,9.03 53.59,14.86 | 53.59,14.86 53.98,15.24 55.12,15.24 55.37,14.99 U1.7
VOLT_CUR  (via drill 0.35, 0.6)
  Top 0.254: R21.2 v52.07,31.05 52.07,30.99 52.83,30.23 53.72,30.23 | 53.72,30.23 53.98,30.23 54.28,30.54 U7.6 | 53.72,30.23 53.72,28.83 55.12,27.43 55.12,23.62 53.21,21.72 53.21,19.43 55.65,16.99 U1.3 57.81,16.99 v58.29,16.51
  Bottom 0.254: D10.A 58.3,16.5 v58.29,16.51 | C1.1 v52.07,31.05
VREF  (via drill 0.6)
  Top 0.254: v54.61,11.49 54.61,12.32 55.78,13.49 U1.10 57.69,13.49 58.17,13.97 58.93,13.97 59.18,13.72 59.18,12.57 58.71,12.1 U1.14
  Bottom 0.254: 54.61,11.32 v54.61,11.49 | U5.1 54.61,11.32 | 54.61,11.32 56.42,11.32 56.77,10.97 R8.1